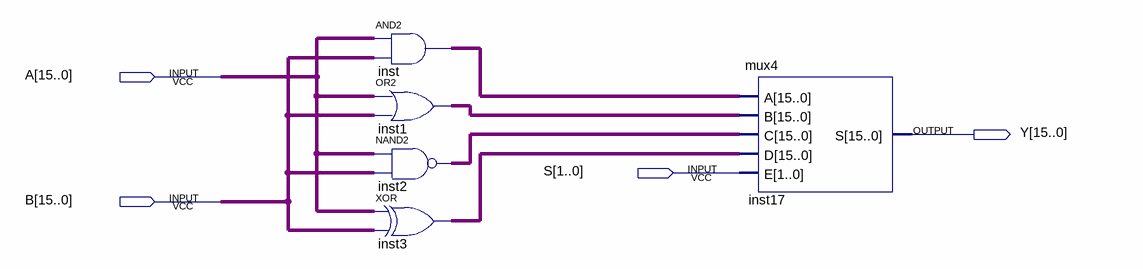
[diagram p0: schematic sheet]
// Quartus schematic LU.bdf as structural Verilog: 5 symbols, 4 pins
module LU (
  input  [15:0] A,
  input  [1:0] S,
  input  [15:0] B,
  output [15:0] Y
);

  wire [15:0] inst1_out, inst2_out, inst3_out, inst_out;

  assign inst_out = A & B;  // AND2 inst, 16 bits wide
  assign inst1_out = A | B;  // OR2 inst1, 16 bits wide
  assign inst2_out = ~(A & B);  // NAND2 inst2, 16 bits wide
  assign inst3_out = A ^ B;  // XOR inst3, 16 bits wide
  mux4 inst17 (.A(inst_out), .B(inst1_out), .C(inst2_out), .D(inst3_out), .E(S), .S(Y));
endmodule
